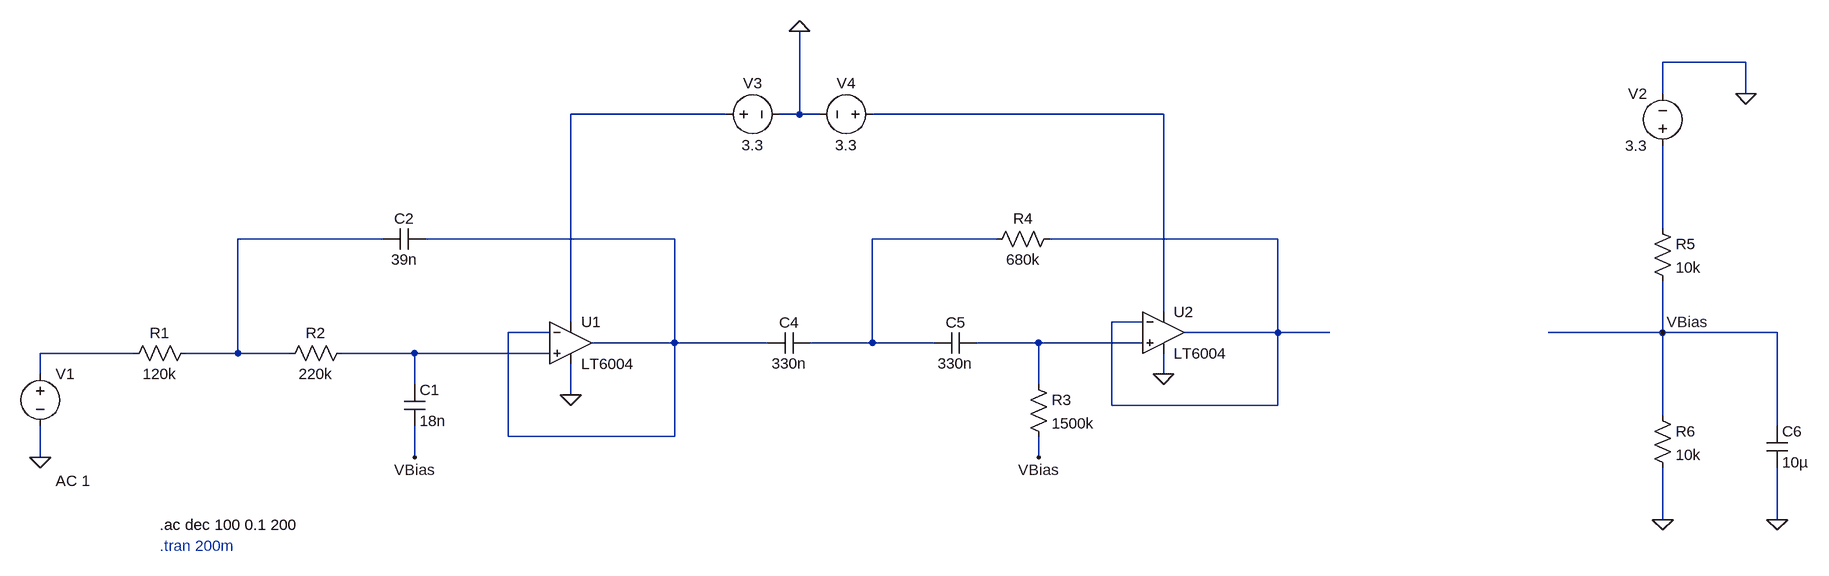
[diagram p0: schematic Filtro Pasabanda Analogico ARES.asc]
Filtro Pasabanda Analogico ARES.asc, the LTspice schematic file:
Version 4.1
SHEET 1 2616 680
WIRE 2512 -240 2384 -240
WIRE 2384 -192 2384 -240
WIRE 2512 -192 2512 -240
WIRE 944 -160 704 -160
WIRE 1056 -160 1056 -288
WIRE 1056 -160 1024 -160
WIRE 1088 -160 1056 -160
WIRE 1616 -160 1168 -160
WIRE 2384 16 2384 -112
WIRE 416 32 192 32
WIRE 864 32 480 32
WIRE 1360 32 1168 32
WIRE 1792 32 1440 32
WIRE 1616 144 1616 -160
WIRE 704 160 704 -160
WIRE 1584 160 1536 160
WIRE 672 176 608 176
WIRE 1792 176 1792 32
WIRE 1792 176 1648 176
WIRE 1872 176 1792 176
WIRE 2384 176 2384 96
WIRE 2384 176 2208 176
WIRE 2560 176 2384 176
WIRE 864 192 864 32
WIRE 864 192 736 192
WIRE 1008 192 864 192
WIRE 1168 192 1168 32
WIRE 1168 192 1072 192
WIRE 1264 192 1168 192
WIRE 1424 192 1328 192
WIRE 1584 192 1424 192
WIRE 32 208 -112 208
WIRE 192 208 192 32
WIRE 192 208 112 208
WIRE 272 208 192 208
WIRE 464 208 352 208
WIRE 672 208 464 208
WIRE -112 240 -112 208
WIRE 1616 240 1616 208
WIRE 464 256 464 208
WIRE 1424 256 1424 192
WIRE 704 272 704 224
WIRE 1536 288 1536 160
WIRE 1792 288 1792 176
WIRE 1792 288 1536 288
WIRE 2384 304 2384 176
WIRE 2560 320 2560 176
WIRE 608 336 608 176
WIRE 864 336 864 192
WIRE 864 336 608 336
WIRE -112 368 -112 320
WIRE 464 368 464 320
WIRE 1424 368 1424 336
WIRE 2384 464 2384 384
WIRE 2560 464 2560 384
FLAG -112 368 0
FLAG 2512 -192 0
FLAG 2384 176 VBias
FLAG 1424 368 VBias
FLAG 464 368 VBias
FLAG 1056 -288 0
FLAG 1616 240 0
FLAG 704 272 0
FLAG 2384 464 0
FLAG 2560 464 0
SYMBOL res 128 192 R90
WINDOW 0 0 56 VBottom 2
WINDOW 3 32 56 VTop 2
SYMATTR InstName R1
SYMATTR Value 120k
SYMBOL res 368 192 R90
WINDOW 0 0 56 VBottom 2
WINDOW 3 32 56 VTop 2
SYMATTR InstName R2
SYMATTR Value 220k
SYMBOL cap 448 256 R0
SYMATTR InstName C1
SYMATTR Value 18n
SYMBOL cap 480 16 R90
WINDOW 0 0 32 VBottom 2
WINDOW 3 32 32 VTop 2
SYMATTR InstName C2
SYMATTR Value 39n
SYMBOL OpAmps\\LT6004 704 192 R0
SYMATTR InstName U1
SYMBOL cap 1072 176 R90
WINDOW 0 0 32 VBottom 2
WINDOW 3 32 32 VTop 2
SYMATTR InstName C4
SYMATTR Value 330n
SYMBOL cap 1328 176 R90
WINDOW 0 0 32 VBottom 2
WINDOW 3 32 32 VTop 2
SYMATTR InstName C5
SYMATTR Value 330n
SYMBOL res 1408 240 R0
SYMATTR InstName R3
SYMATTR Value 1500k
SYMBOL res 1456 16 R90
WINDOW 0 0 56 VBottom 2
WINDOW 3 32 56 VTop 2
SYMATTR InstName R4
SYMATTR Value 680k
SYMBOL OpAmps\\LT6004 1616 176 R0
SYMATTR InstName U2
SYMBOL voltage -112 224 R0
WINDOW 3 24 152 Left 2
WINDOW 123 24 180 Left 2
WINDOW 39 0 0 Left 0
SYMATTR Value ""
SYMATTR Value2 AC 1
SYMATTR InstName V1
SYMBOL voltage 2384 -96 R180
WINDOW 0 24 96 Left 2
WINDOW 3 24 16 Left 2
WINDOW 123 0 0 Left 0
WINDOW 39 0 0 Left 0
SYMATTR InstName V2
SYMATTR Value 3.3
SYMBOL res 2368 0 R0
SYMATTR InstName R5
SYMATTR Value 10k
SYMBOL res 2368 288 R0
SYMATTR InstName R6
SYMATTR Value 10k
SYMBOL cap 2544 320 R0
SYMATTR InstName C6
SYMATTR Value 10µ
SYMBOL voltage 1184 -160 R90
WINDOW 0 -32 56 VBottom 2
WINDOW 3 32 56 VTop 2
WINDOW 123 0 0 Left 0
WINDOW 39 0 0 Left 0
SYMATTR InstName V4
SYMATTR Value 3.3
SYMBOL voltage 928 -160 R270
WINDOW 0 32 56 VTop 2
WINDOW 3 -32 56 VBottom 2
WINDOW 123 0 0 Left 0
WINDOW 39 0 0 Left 0
SYMATTR InstName V3
SYMATTR Value 3.3
TEXT 72 472 Left 2 !.ac dec 100 0.1 200
TEXT 72 504 Left 2 ;.tran 200m

The netlist it stands for:
* Filtro Pasabanda Analogico ARES.asc
R1 N004 N009 120k
R2 N010 N004 220k
C1 N010 VBias 18n
C2 N005 N004 39n
* U1: LT6004 (symbol OpAmps\LT6004 not available, pins judged from their places): In+=N010 In-=N005 V+=N001 V-=0 OUT=N005
C4 N006 N005 330n
C5 N008 N006 330n
R3 N008 VBias 1500k
R4 N007 N006 680k
* U2: LT6004 (symbol OpAmps\LT6004 not available, pins judged from their places): In+=N008 In-=N007 V+=N002 V-=0 OUT=N007
V1 N009 0 AC 1
V2 N003 0 3.3
R5 N003 VBias 10k
R6 VBias 0 10k
C6 VBias 0 10µ
V4 N002 0 3.3
V3 N001 0 3.3
.ac dec 100 0.1 200
* .tran 200m
.backanno
.end